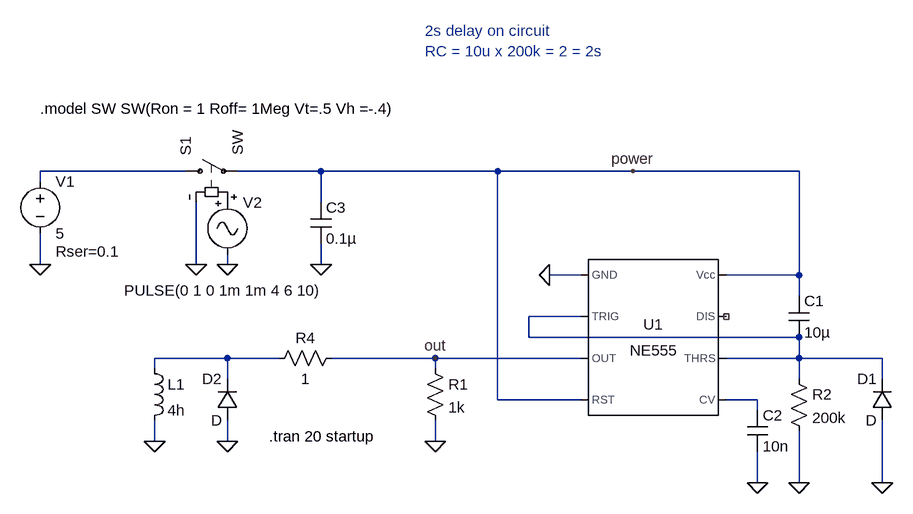
[diagram p0: schematic NE555_delay_on_2s.asc]
NE555_delay_on_2s.asc, the LTspice schematic file:
Version 4
SHEET 1 880 680
WIRE -512 -64 -736 -64
WIRE -304 -64 -432 -64
WIRE -32 -64 -304 -64
WIRE 176 -64 -32 -64
WIRE 432 -64 176 -64
WIRE -736 -48 -736 -64
WIRE -304 -16 -304 -64
WIRE -736 80 -736 32
WIRE -496 80 -496 -16
WIRE -448 80 -448 64
WIRE -304 80 -304 48
WIRE 96 96 48 96
WIRE 432 96 432 -64
WIRE 432 96 320 96
WIRE 432 128 432 96
WIRE 96 160 16 160
WIRE 16 192 16 160
WIRE 432 192 16 192
WIRE -448 224 -560 224
WIRE -368 224 -448 224
WIRE -128 224 -288 224
WIRE 96 224 -128 224
WIRE 432 224 432 192
WIRE 432 224 320 224
WIRE 560 224 432 224
WIRE -560 240 -560 224
WIRE -128 240 -128 224
WIRE -448 256 -448 224
WIRE 432 256 432 224
WIRE 560 256 560 224
WIRE -32 288 -32 -64
WIRE 96 288 -32 288
WIRE 368 288 320 288
WIRE 368 304 368 288
WIRE -560 352 -560 320
WIRE -448 352 -448 320
WIRE -128 352 -128 320
WIRE 368 416 368 368
WIRE 432 416 432 336
WIRE 560 416 560 320
FLAG -736 80 0
FLAG -128 352 0
FLAG 48 96 0
FLAG 432 416 0
FLAG 560 416 0
FLAG 368 416 0
FLAG -304 80 0
FLAG -560 352 0
FLAG -448 352 0
FLAG -448 80 0
FLAG -496 80 0
FLAG 176 -64 power
FLAG -128 224 out
SYMBOL Misc\\NE555 208 192 R0
SYMATTR InstName U1
SYMBOL voltage -736 -64 R0
WINDOW 123 0 0 Left 0
WINDOW 39 24 124 Left 2
SYMATTR SpiceLine Rser=0.1
SYMATTR InstName V1
SYMATTR Value 5
SYMBOL res -144 224 R0
SYMATTR InstName R1
SYMATTR Value 1k
SYMBOL sw -528 -64 R270
SYMATTR InstName S1
SYMBOL Misc\\signal -448 -32 R0
WINDOW 3 -159 152 Left 2
WINDOW 123 0 0 Left 0
WINDOW 39 0 0 Left 0
SYMATTR Value PULSE(0 1 0 1m 1m 4 6 10)
SYMATTR InstName V2
SYMBOL cap 416 128 R0
SYMATTR InstName C1
SYMATTR Value 10µ
SYMBOL res 416 240 R0
SYMATTR InstName R2
SYMATTR Value 200k
SYMBOL diode 576 320 R180
WINDOW 0 24 64 Left 2
WINDOW 3 24 0 Left 2
SYMATTR InstName D1
SYMBOL cap 352 304 R0
SYMATTR InstName C2
SYMATTR Value 10n
SYMBOL cap -320 -16 R0
SYMATTR InstName C3
SYMATTR Value 0.1µ
SYMBOL ind -576 224 R0
SYMATTR InstName L1
SYMATTR Value 4h
SYMATTR SpiceLine Rser=600
SYMBOL diode -432 320 R180
WINDOW 0 24 64 Left 2
WINDOW 3 24 0 Left 2
SYMATTR InstName D2
SYMBOL res -272 208 R90
WINDOW 0 0 56 VBottom 2
WINDOW 3 32 56 VTop 2
SYMATTR InstName R4
SYMATTR Value 1
TEXT -384 344 Left 2 !.tran 20 startup
TEXT -736 -160 Left 2 !.model SW SW(Ron = 1 Roff= 1Meg Vt=.5 Vh =-.4)
TEXT -144 -280 Left 2 ;2s delay on circuit\nRC = 10u x 200k = 2 = 2s

The netlist it stands for:
* NE555_delay_on_2s.asc
XU1 0 N002 out power N004 N002 NC_01 power NE555  ; pins GND TRIG OUT RST CV THRS DIS Vcc
V1 N001 0 5 Rser=0.1
R1 out 0 1k
S1 N001 power P001 0 SW
V2 P001 0 PULSE(0 1 0 1m 1m 4 6 10)
C1 power N002 10µ
R2 N002 0 200k
D1 0 N002 D
C2 N004 0 10n
C3 power 0 0.1µ
L1 N003 0 4h Rser=600
D2 0 N003 D
R4 out N003 1
.model D D
.lib standard.dio
.tran 20 startup
.model SW SW(Ron = 1 Roff= 1Meg Vt=.5 Vh =-.4)
* 2s delay on circuit
* RC = 10u x 200k = 2 = 2s
.lib NE555.sub
.backanno
.end